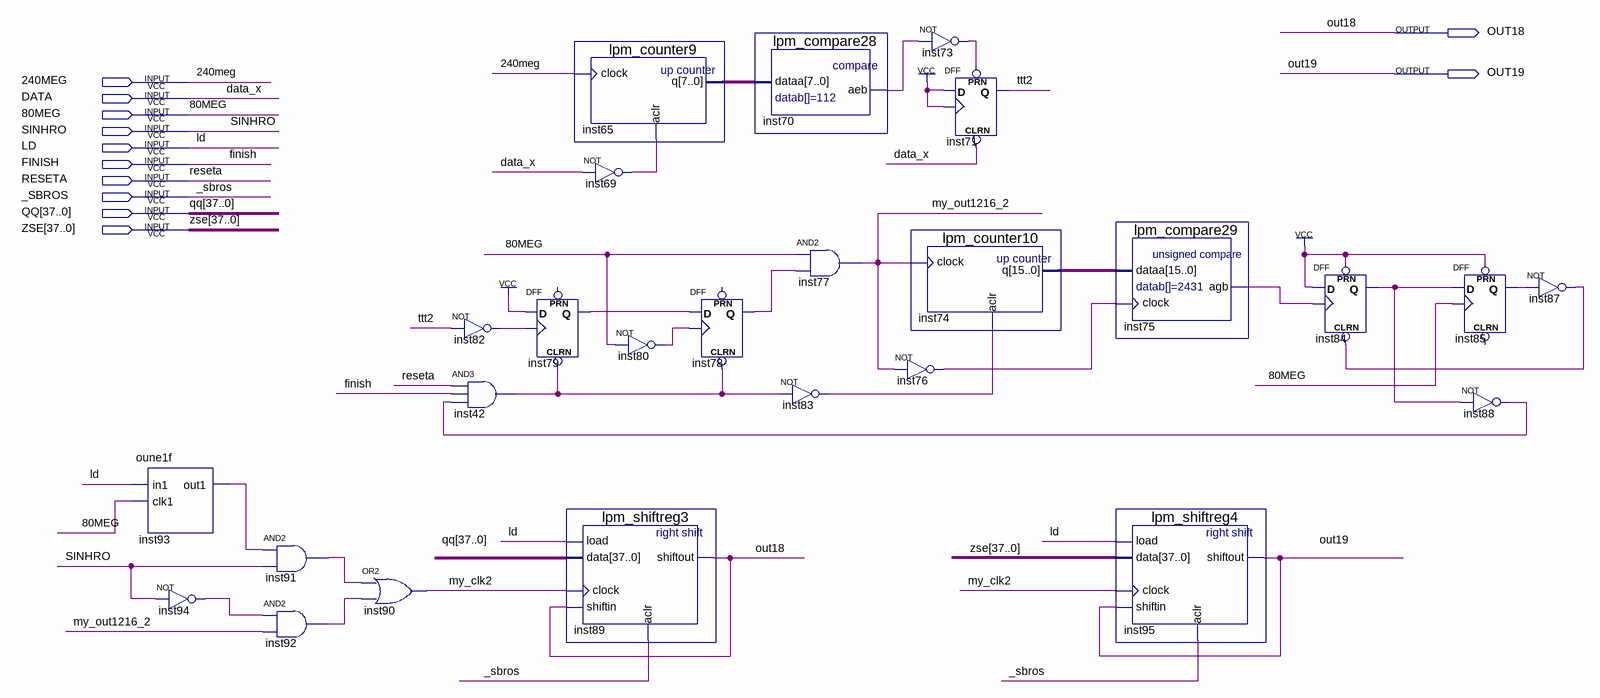
[diagram p0: schematic sheet]
// Quartus schematic Block_Synchro_Data.bdf as structural Verilog: 26 symbols, 12 pins
module Block_Synchro_Data (
  input  \240MEG ,
  input  DATA,
  input  \80MEG ,
  input  SINHRO,
  input  LD,
  input  FINISH,
  input  RESETA,
  input  _SBROS,
  input  [37:0] QQ,
  input  [37:0] ZSE,
  output OUT18,
  output OUT19
);

  wire inst42_out, inst69_out, inst70_aeb, inst73_out, inst75_agb, inst76_out, inst78_q, inst79_q,
       inst80_out, inst82_out, inst83_out, inst84_q, inst85_q, inst87_out, inst88_out, inst91_out,
       inst92_out, inst93_out1, inst94_out, my_clk2, my_out1216_2, ttt2;
  wire [7:0] inst65_q;
  wire [15:0] inst74_q;

  oune1f inst93 (.in1(LD), .clk1(\80MEG ), .out1(inst93_out1));
  not inst94 (inst94_out, SINHRO);
  and inst91 (inst91_out, inst93_out1, SINHRO);
  and inst92 (inst92_out, inst94_out, my_out1216_2);
  or inst90 (my_clk2, inst91_out, inst92_out);
  not inst82 (inst82_out, ttt2);
  and inst42 (inst42_out, RESETA, FINISH, inst88_out);
  DFF inst79 (.CLRN(inst42_out), .CLK(inst82_out), .D(1'b1), .Q(inst79_q));  // open: PRN
  lpm_counter9 inst65 (.clock(\240MEG ), .aclr(inst69_out), .q(inst65_q));
  not inst69 (inst69_out, DATA);
  lpm_shiftreg3 inst89 (.load(LD), .data(QQ), .clock(my_clk2), .shiftin(OUT18), .aclr(_SBROS), .shiftout(OUT18));
  not inst80 (inst80_out, \80MEG );
  DFF inst78 (.CLRN(inst42_out), .CLK(inst80_out), .D(inst79_q), .Q(inst78_q));  // open: PRN
  lpm_compare28 inst70 (.dataa(inst65_q), .aeb(inst70_aeb));
  not inst83 (inst83_out, inst42_out);
  and inst77 (my_out1216_2, \80MEG , inst78_q);
  not inst73 (inst73_out, inst70_aeb);
  lpm_counter10 inst74 (.clock(my_out1216_2), .aclr(inst83_out), .q(inst74_q));
  not inst76 (inst76_out, my_out1216_2);
  DFF inst71 (.CLRN(DATA), .CLK(1'b1), .D(1'b1), .PRN(inst73_out), .Q(ttt2));
  lpm_compare29 inst75 (.dataa(inst74_q), .clock(inst76_out), .agb(inst75_agb));
  lpm_shiftreg4 inst95 (.load(LD), .data(ZSE), .clock(my_clk2), .shiftin(OUT19), .aclr(_SBROS), .shiftout(OUT19));
  DFF inst84 (.CLRN(inst87_out), .CLK(inst75_agb), .D(1'b1), .PRN(1'b1), .Q(inst84_q));
  DFF inst85 (.CLK(\80MEG ), .D(inst84_q), .PRN(1'b1), .Q(inst85_q));  // open: CLRN
  not inst88 (inst88_out, inst84_q);
  not inst87 (inst87_out, inst85_q);

  // Other names for the same wires on the sheet: data_x = DATA
endmodule
